# Altium schematic sheet BLE_Connectivity.SchDoc
size A4; SheetNumber: 5; SheetTotal: 11
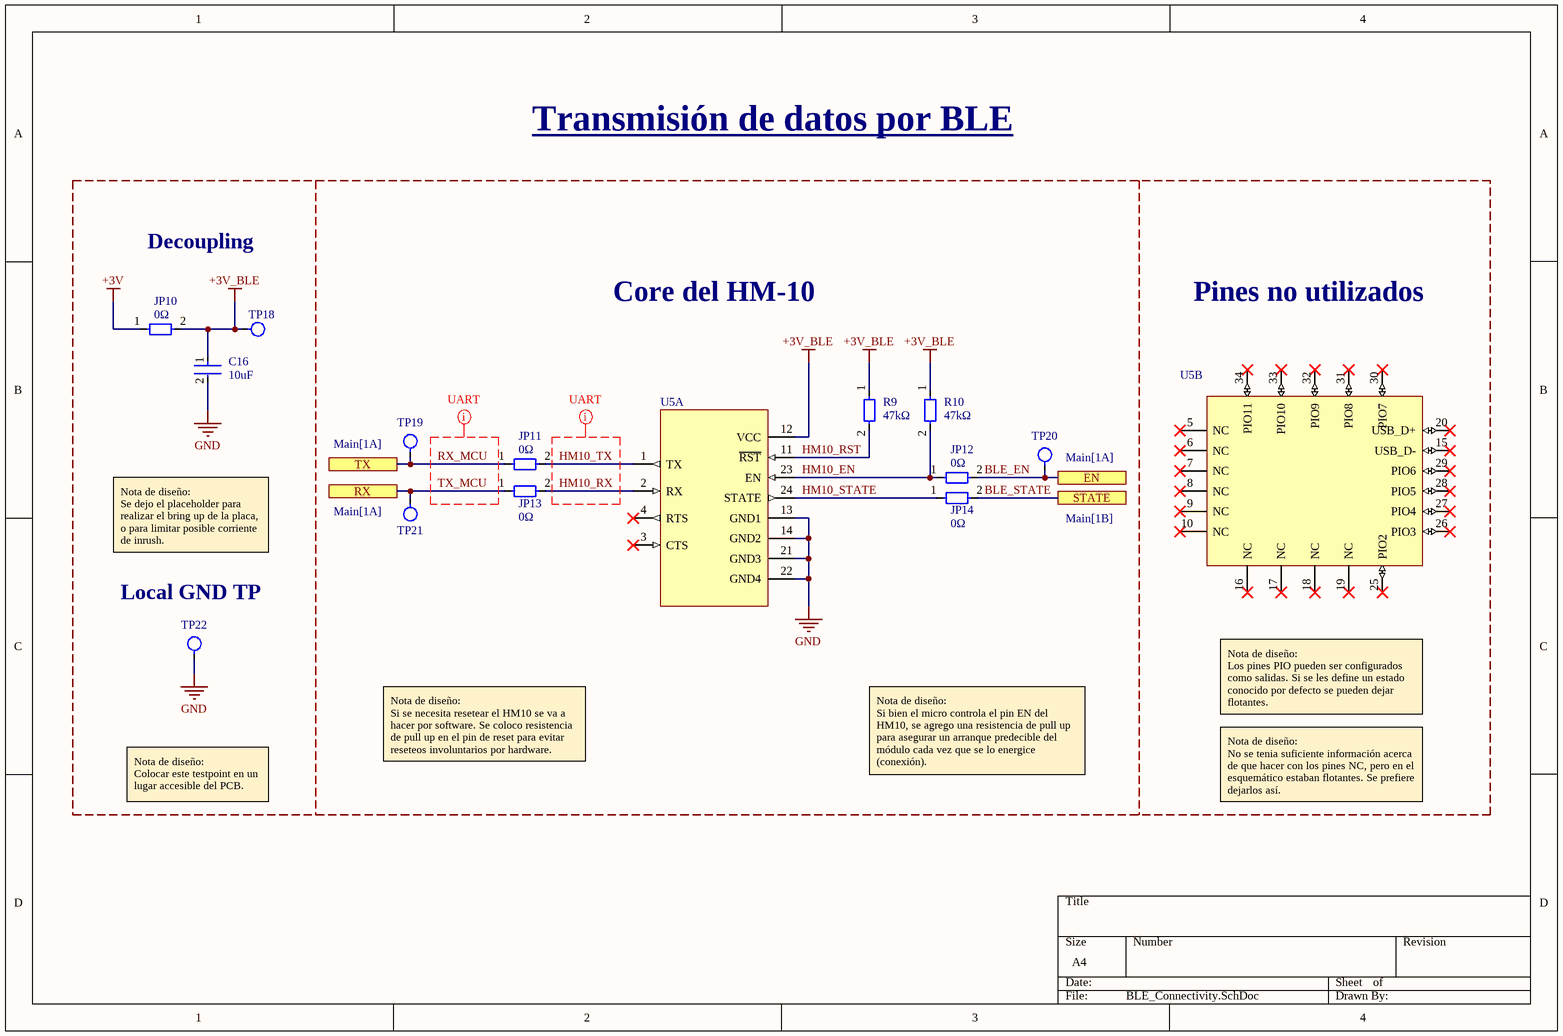
[diagram p0: BLE_Connectivity.SchDoc]

## Parts
C16  10uF  [CAP_0603]
JP10  value 0Ω  [RES_0R_0603]  (hidden comment: Generic JP)  (no BOM)
JP11  value 0Ω  [RES_0R_0603]  (hidden comment: Generic JP)  (no BOM)
JP12  value 0Ω  [RES_0R_0603]  (hidden comment: Generic JP)  (no BOM)
JP13  value 0Ω  [RES_0R_0603]  (hidden comment: Generic JP)  (no BOM)
JP14  value 0Ω  [RES_0R_0603]  (hidden comment: Generic JP)  (no BOM)
R9  value 47kΩ  [RES_0603]  (hidden comment: 47k)
R10  value 47kΩ  [RES_0603]  (hidden comment: 47k)
TP18  Testpoint SMD  [Testpoint_SMD]  (value not drawn)  (no BOM)
TP19  Testpoint SMD  [Testpoint_SMD]  (value not drawn)  (no BOM)
TP20  Testpoint SMD  [Testpoint_SMD]  (value not drawn)  (no BOM)
TP21  Testpoint SMD  [Testpoint_SMD]  (value not drawn)  (no BOM)
TP22  Testpoint SMD  [Testpoint_SMD]  (value not drawn)  (no BOM)
U5  HM10 BLE Module  [HM10_FOOTPRINT]  (value not drawn)  (parts A,B of 2)

## Ports
EN (see Main[1A]), RX (see Main[1A]), STATE (see Main[1B]), TX (see Main[1A])

## Nets
+3V: JP10.1
+3V_BLE: C16.1 JP10.2 R9.1 R10.1 TP18.1 U5.12(VCC)
GND: C16.2 TP22.1 U5.13(GND1) U5.14(GND2) U5.21(GND3) U5.22(GND4)
BLE_EN: JP12.2 TP20.1 ; port EN
BLE_STATE: JP14.2 ; port STATE
HM10_EN: JP12.1 R10.2 U5.23(EN)
HM10_RST: R9.2 U5.11(~{RST})
HM10_RX: JP13.2 U5.2(RX)
HM10_STATE: JP14.1 U5.24(STATE)
HM10_TX: JP11.2 U5.1(TX)
RX_MCU: JP11.1 TP19.1 ; port TX
TX_MCU: JP13.1 TP21.1 ; port RX

Not connected (* = marked no-connect by the designer): U5 3(CTS)* 4(RTS)* 5(NC)* 6(NC)* 7(NC)* 8(NC)* 9(NC)* 10(NC)* 15(USB_D-)* 16(NC)* 17(NC)* 18(NC)* 19(NC)* 20(USB_D+)* 25(PIO2)* 26(PIO3)* 27(PIO4)* 28(PIO5)* 29(PIO6)* 30(PIO7)* 31(PIO8)* 32(PIO9)* 33(PIO10)* 34(PIO11)*

## Layout directives
net class UART: HM10_RX, HM10_TX, RX_MCU, TX_MCU

## Notes on the sheet
- Transmisión de datos por BLE
- Decoupling
- Core del HM-10
- Pines no utilizados
- Nota de diseño:
  Se dejo el placeholder para realizar el bring up de la placa, o para limitar posible corriente de inrush.
- (near TP22) Local GND TP
- Nota de diseño:
  Los pines PIO pueden ser configurados como salidas. Si se les define un estado conocido por defecto se pueden dejar flotantes.
- Nota de diseño:
  Si se necesita resetear el HM10 se va a hacer por software. Se coloco resistencia de pull up en el pin de reset para evitar reseteos involuntarios por hardware.
- Nota de diseño:
  Si bien el micro controla el pin EN del HM10, se agrego una resistencia de pull up para asegurar un arranque predecible del módulo cada vez que se lo energice (conexión).
- Nota de diseño:
  Colocar este testpoint en un lugar accesible del PCB.
- Nota de diseño:
  No se tenia suficiente información acerca de que hacer con los pines NC, pero en el esquemático estaban flotantes. Se prefiere dejarlos así.

## Library data of the parts
C16 = Generic C: Cap 10 uF 10V X7R 0603; Dielectric: X5R; Tolerance: 10%; Case Code (Imperial): 0805; Capacitance: 10uF; Mount: Surface Mount; Depth: 1.25mm; Length: 2mm; Lead Free: Lead Free; Packaging: Tape and Reel; Width: 0.049inch; Package Quantity: 1; Height: 1.25mm; Case/Package: 0805; Voltage Rating: 10V; Thickness: 0.053inch; Max Operating Temperature: 85°C; Case Code (Metric): 2012; Contact Plating: Tin; Min Operating Temperature: -55°C; Radiation Hardening: No; Voltage Rating (DC): 10V
JP10-JP14 = Generic JP: Simbolo de jumper genérico
R9 R10 = Generic R: RES  47k 1% 0603
TP18-TP22 = Testpoint_SMD: Testpoint SMD de 1mm de diametro.
U5 = HM10: Modulo BLE HM10 con castellated pads.